# Altium schematic sheet driver VCC.SchDoc
size A4; SheetNumber: 2; SheetTotal: 4
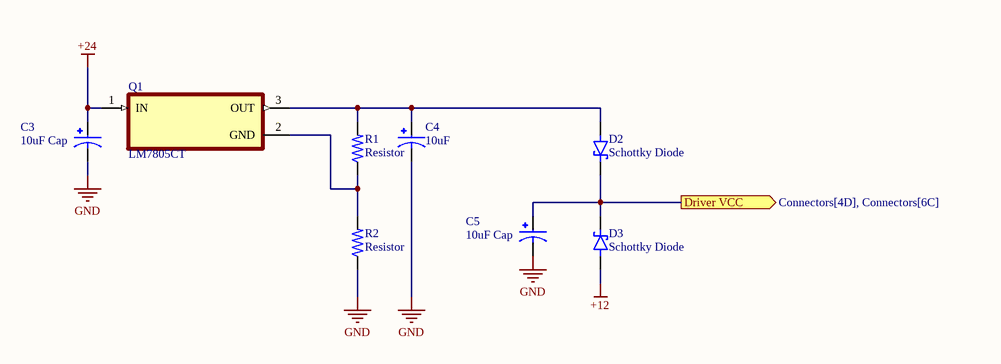
[diagram p0: driver VCC.SchDoc]

## Parts
C3  10uF Cap  [CAP_10uF]
C4  10uF  [CAP_10uF]
C5  10uF Cap  [CAP_10uF]
D2  Schottky Diode  [Common Trhough Hole]
D3  Schottky Diode  [Common Trhough Hole]
Q1  LM7805CT  [LM7805CT]
R1  Resistor  [Resistor_Through Hole]
R2  Resistor  [Resistor_Through Hole]

## Ports
Driver VCC (out, see Connectors[4D], Connectors[6C])

## Nets
+12: D3.2(A)
+24: C3.P Q1.1(IN)
GND: C3.N C4.N C5.N R2.1
Driver VCC: C5.P D2.1(K) D3.1(K) ; port Driver VCC
NetC4_P: C4.P D2.2(A) Q1.3(OUT) R1.2
NetQ1_2: Q1.2(GND) R1.1 R2.2

## Library data of the parts
C3-C5 = 10uF Cap: CAP ALUM 10UF 20% 50V RADIAL; MP: ECE-A1HN100UI; MF: Panasonic; SnapEDA_Link: https://www.snapeda.com/parts/ECE-A1HN100UI/Panasonic/view-part/2321690/?ref=snap; Price: None; Check_prices: https://www.snapeda.com/parts/ECE-A1HN100UI/Panasonic/view-part/2321690/?ref=eda; Value: *; Availability: In Stock; Package: RADIAL-2 Panasonic
D2 D3 = Schottky Diode: MF: Diodes Inc.; MP: 1N5817-T; Package: DO-41 Diodes Inc.; Price: None; Check_prices: https://www.snapeda.com/parts/1N5817-T/Diodes+Inc./view-part/?ref=eda; Value: *; SnapEDA_Link: https://www.snapeda.com/parts/1N5817-T/Diodes+Inc./view-part/?ref=snap; Availability: In Stock; Purchase-URL: https://pricing.snapeda.com/search/part/1N5817-T/?ref=eda
Q1 = LM7805CT: MP: LM7805CT/NOPB; Price: None; Availability: Unavailable; Value: *; Package: None
R1 R2 = Resistor: Power_Rating: .25 W; MP: 2-2176053-0; Tolerance: 1%; Resistance: .33; MF: TE Connectivity; Price: None; Availability: In Stock; EU_RoHS_Compliance: Compliant with Exemptions; Package: 0805; Value: *; SnapEDA_Link: https://www.snapeda.com/parts/2-2176053-0/TE+Connectivity/view-part/?ref=snap; Check_prices: https://www.snapeda.com/parts/2-2176053-0/TE+Connectivity/view-part/?ref=eda